# EAGLE design cv-display (EAGLE 9.6.2)
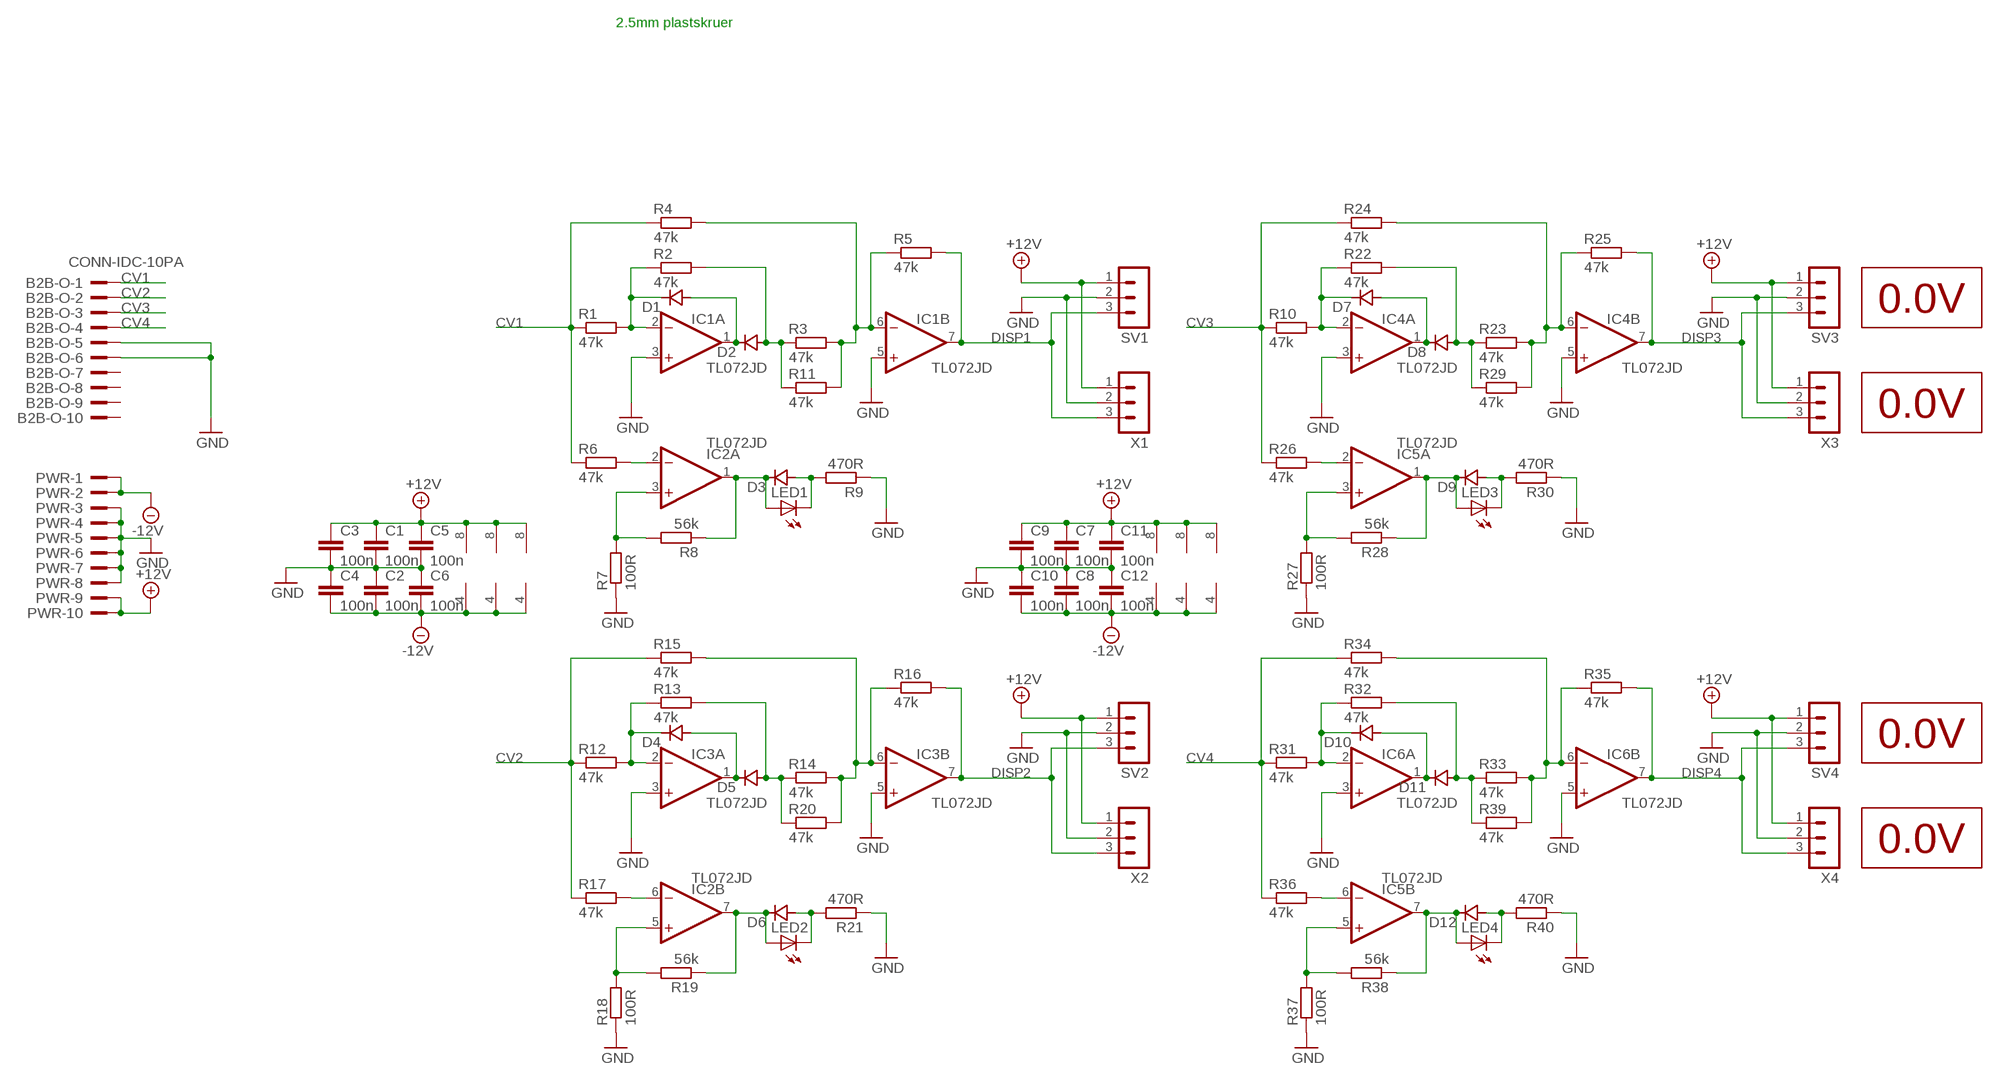
[diagram p0: schematic, sheet 1]

## Parts
B2B-O  CONN-IDC-10PA  [CONN-IDC10P-A]
C1  100n  C-EUC0603  [C0603]
C2  100n  C-EUC0603  [C0603]
C3  100n  C-EUC0603  [C0603]
C4  100n  C-EUC0603  [C0603]
C5  100n  C-EUC0603  [C0603]
C6  100n  C-EUC0603  [C0603]
C7  100n  C-EUC0603  [C0603]
C8  100n  C-EUC0603  [C0603]
C9  100n  C-EUC0603  [C0603]
C10  100n  C-EUC0603  [C0603]
C11  100n  C-EUC0603  [C0603]
C12  100n  C-EUC0603  [C0603]
D1  1N4148SOD323  [SOD323J]
D2  1N4148SOD323  [SOD323J]
D3  1N4148SOD323  [SOD323J]
D4  1N4148SOD323  [SOD323J]
D5  1N4148SOD323  [SOD323J]
D6  1N4148SOD323  [SOD323J]
D7  1N4148SOD323  [SOD323J]
D8  1N4148SOD323  [SOD323J]
D9  1N4148SOD323  [SOD323J]
D10  1N4148SOD323  [SOD323J]
D11  1N4148SOD323  [SOD323J]
D12  1N4148SOD323  [SOD323J]
IC1  TL072JD  [SO08J]
IC2  TL072JD  [SO08J]
IC3  TL072JD  [SO08J]
IC4  TL072JD  [SO08J]
IC5  TL072JD  [SO08J]
IC6  TL072JD  [SO08J]
IC7  VOLTMETER  [VOLTMETER]
IC8  VOLTMETER  [VOLTMETER]
IC9  VOLTMETER  [VOLTMETER]
IC10  VOLTMETER  [VOLTMETER]
LED1  LED_J2X4  [LED2X4-J]
LED2  LED_J2X4  [LED2X4-J]
LED3  LED_J2X4  [LED2X4-J]
LED4  LED_J2X4  [LED2X4-J]
PWR  CONN-IDC-10PA  [CONN-IDC10P-A]
R1  47k  R-EU_R0603  [R0603]
R2  47k  R-EU_R0603  [R0603]
R3  47k  R-EU_R0603  [R0603]
R4  47k  R-EU_R0603  [R0603]
R5  47k  R-EU_R0603  [R0603]
R6  47k  R-EU_R0603  [R0603]
R7  100R  R-EU_R0603  [R0603]
R8  56k  R-EU_R0603  [R0603]
R9  470R  R-EU_R0603  [R0603]
R10  47k  R-EU_R0603  [R0603]
R11  47k  R-EU_R0603  [R0603]
R12  47k  R-EU_R0603  [R0603]
R13  47k  R-EU_R0603  [R0603]
R14  47k  R-EU_R0603  [R0603]
R15  47k  R-EU_R0603  [R0603]
R16  47k  R-EU_R0603  [R0603]
R17  47k  R-EU_R0603  [R0603]
R18  100R  R-EU_R0603  [R0603]
R19  56k  R-EU_R0603  [R0603]
R20  47k  R-EU_R0603  [R0603]
R21  470R  R-EU_R0603  [R0603]
R22  47k  R-EU_R0603  [R0603]
R23  47k  R-EU_R0603  [R0603]
R24  47k  R-EU_R0603  [R0603]
R25  47k  R-EU_R0603  [R0603]
R26  47k  R-EU_R0603  [R0603]
R27  100R  R-EU_R0603  [R0603]
R28  56k  R-EU_R0603  [R0603]
R29  47k  R-EU_R0603  [R0603]
R30  470R  R-EU_R0603  [R0603]
R31  47k  R-EU_R0603  [R0603]
R32  47k  R-EU_R0603  [R0603]
R33  47k  R-EU_R0603  [R0603]
R34  47k  R-EU_R0603  [R0603]
R35  47k  R-EU_R0603  [R0603]
R36  47k  R-EU_R0603  [R0603]
R37  100R  R-EU_R0603  [R0603]
R38  56k  R-EU_R0603  [R0603]
R39  47k  R-EU_R0603  [R0603]
R40  470R  R-EU_R0603  [R0603]
SV1  MA03-1JC  [MA03-1J]
SV2  MA03-1JC  [MA03-1J]
SV3  MA03-1JC  [MA03-1J]
SV4  MA03-1JC  [MA03-1J]
X1  WJ300V-5.0-3P  [WJ300V-5.0-3P]
X2  WJ300V-5.0-3P  [WJ300V-5.0-3P]
X3  WJ300V-5.0-3P  [WJ300V-5.0-3P]
X4  WJ300V-5.0-3P  [WJ300V-5.0-3P]

## Nets
+12V: C1.1 C3.1 C5.1 C7.1 C9.1 C11.1 IC1.8(P:V+) IC2.8(P:V+) IC3.8(P:V+) IC4.8(P:V+) IC5.8(P:V+) IC6.8(P:V+) PWR.9 PWR.10 SV1.1 SV2.1 SV3.1 SV4.1 X1.1 X2.1 X3.1 X4.1
-12V: C2.2 C4.2 C6.2 C8.2 C10.2 C12.2 IC1.4(P:V-) IC2.4(P:V-) IC3.4(P:V-) IC4.4(P:V-) IC5.4(P:V-) IC6.4(P:V-) PWR.1 PWR.2
CV1: B2B-O.1 R1.1 R4.1 R6.1
CV2: B2B-O.2 R12.1 R15.1 R17.1
CV3: B2B-O.3 R10.1 R24.1 R26.1
CV4: B2B-O.4 R31.1 R34.1 R36.1
DISP1: IC1.7(B:OUT) R5.2 SV1.3 X1.3
DISP2: IC3.7(B:OUT) R16.2 SV2.3 X2.3
DISP3: IC4.7(B:OUT) R25.2 SV3.3 X3.3
DISP4: IC6.7(B:OUT) R35.2 SV4.3 X4.3
GND: B2B-O.5 B2B-O.6 C1.2 C2.1 C3.2 C4.1 C5.2 C6.1 C7.2 C8.1 C9.2 C10.1 C11.2 C12.1 IC1.3(A:+IN) IC1.5(B:+IN) IC3.3(A:+IN) IC3.5(B:+IN) IC4.3(A:+IN) IC4.5(B:+IN) IC6.3(A:+IN) IC6.5(B:+IN) PWR.3 PWR.4 PWR.5 PWR.6 PWR.7 PWR.8 R7.1 R9.1 R18.1 R21.1 R27.1 R30.1 R37.1 R40.1 SV1.2 SV2.2 SV3.2 SV4.2 X1.2 X2.2 X3.2 X4.2
N$1: D1.1(C) IC1.2(A:-IN) R1.2 R2.1
N$2: D1.2(A) D2.1(C) IC1.1(A:OUT)
N$3: IC2.3(A:+IN) R7.2 R8.2
N$4: D2.2(A) R2.2 R3.1 R11.1
N$5: D7.1(C) IC4.2(A:-IN) R10.2 R22.1
N$6: D3.1(C) IC2.1(A:OUT) LED1.ANODE(A) R8.1
N$7: D7.2(A) D8.1(C) IC4.1(A:OUT)
N$8: IC1.6(B:-IN) R3.2 R4.2 R5.1 R11.2
N$9: IC2.2(A:-IN) R6.2
N$10: D8.2(A) R22.2 R23.1 R29.1
N$11: IC4.6(B:-IN) R23.2 R24.2 R25.1 R29.2
N$12: D3.2(A) LED1.CATHODE(C) R9.2
N$13: D4.1(C) IC3.2(A:-IN) R12.2 R13.1
N$14: D4.2(A) D5.1(C) IC3.1(A:OUT)
N$15: D5.2(A) R13.2 R14.1 R20.1
N$16: IC3.6(B:-IN) R14.2 R15.2 R16.1 R20.2
N$17: IC2.6(B:-IN) R17.2
N$18: IC2.5(B:+IN) R18.2 R19.2
N$19: D6.1(C) IC2.7(B:OUT) LED2.ANODE(A) R19.1
N$20: D6.2(A) LED2.CATHODE(C) R21.2
N$21: IC5.2(A:-IN) R26.2
N$22: IC5.3(A:+IN) R27.2 R28.2
N$23: D9.1(C) IC5.1(A:OUT) LED3.ANODE(A) R28.1
N$24: D9.2(A) LED3.CATHODE(C) R30.2
N$25: D10.1(C) IC6.2(A:-IN) R31.2 R32.1
N$26: D10.2(A) D11.1(C) IC6.1(A:OUT)
N$27: D11.2(A) R32.2 R33.1 R39.1
N$28: IC6.6(B:-IN) R33.2 R34.2 R35.1 R39.2
N$29: IC5.6(B:-IN) R36.2
N$30: IC5.5(B:+IN) R37.2 R38.2
N$31: D12.1(C) IC5.7(B:OUT) LED4.ANODE(A) R38.1
N$32: D12.2(A) LED4.CATHODE(C) R40.2
Unconnected: B2B-O.7 B2B-O.8 B2B-O.9 B2B-O.10

## Notes on the sheet
- 2.5mm plastskruer

## Library data of the parts
B2B-O PWR = joakim:CONN-IDC-10P: 10P IDC Header; OC_FARNELL: 1788669; OC_NEWARK: unknown
C1-C12 = rcl:C-EU: CAPACITOR, European symbol; SPICEPREFIX: C
D1-D12 = joakim:1N4148: DIODE high speed (Philips)
IC1-IC6 = joakim:TL072J: OP AMP
IC7-IC10 = joakim:VOLTMETER
LED1-LED4 = joakim-old:LED_J: LED Everlight: rectangular 2 x 4 mm, 594
R1-R40 = rcl:R-EU_: RESISTOR, European symbol; SPICEPREFIX: R
SV1-SV4 = joakim:MA03-1J: PIN HEADER; OC_FARNELL: unknown; OC_NEWARK: unknown
X1-X4 = joakim:WJ300V-5.0-3P: 3p screw terminal Ningbo Kangnex Elec WJ300V-5.0-3P JLCPCB: C8467 5mm pin pitch

## Board
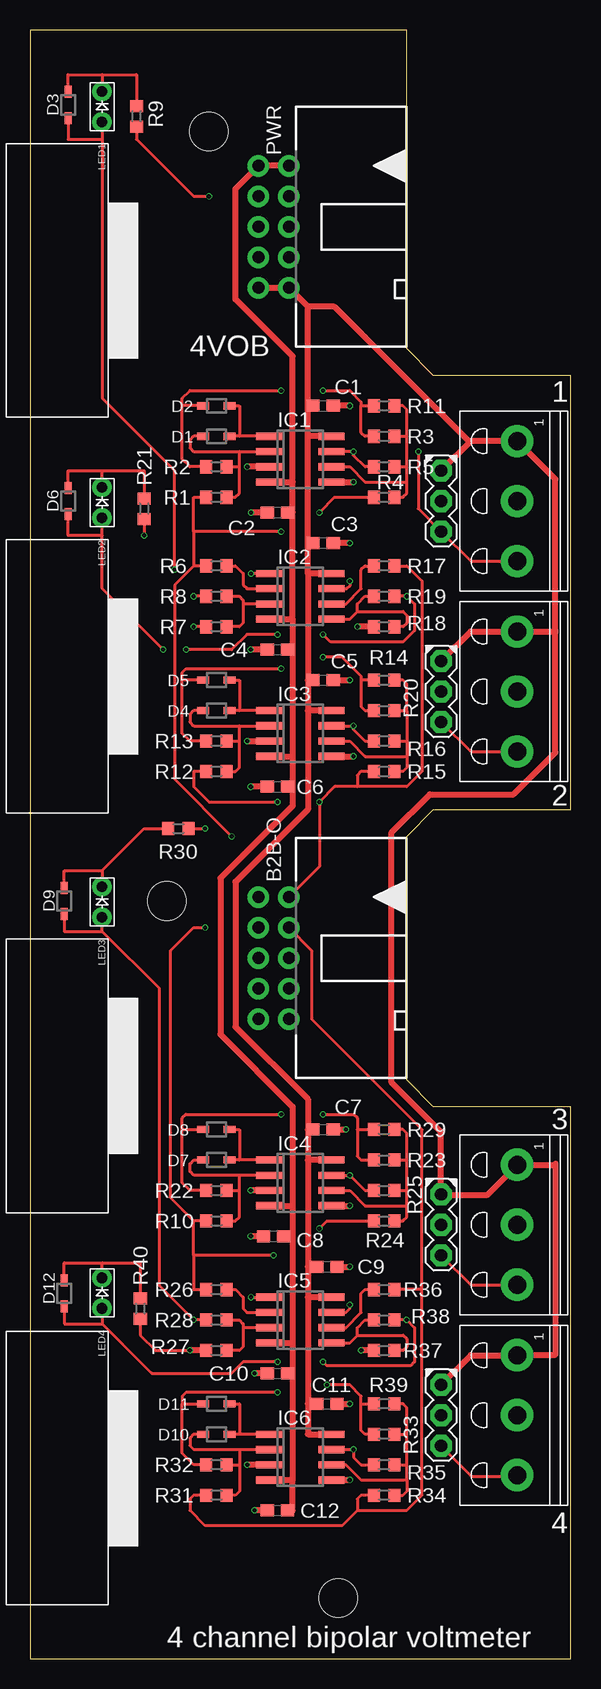
[diagram p1: board, top side]
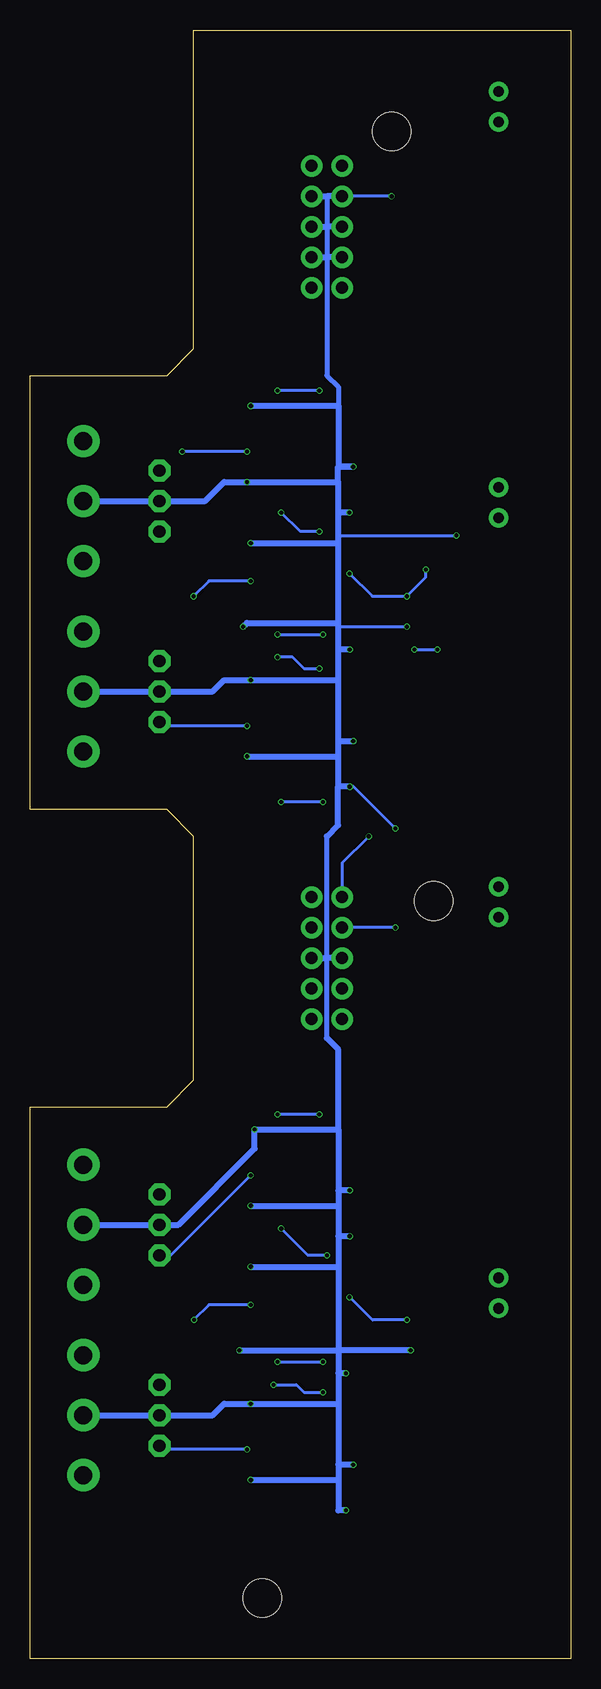
[diagram p2: board, bottom side, seen from below]

Size 45.09 x 135.79 mm. Coordinates in mm from the lower left corner, seen from the top.
Outline: 0,0 45.09,0 45.09,46.04 33.66,46.04 31.43,48.26 31.43,68.58 33.66,70.8 45.09,70.8 45.09,107 33.66,107 31.43,109.22 31.43,135.79 0,135.79 0,0
Copper layers (1*16): Top 0.035mm / dielectric 1.6mm / Bottom 0.035mm
Design rules "jlcpcb-2layers": minimum track width 5mil, minimum drill 0.3mm, track to track 5mil, track to pad 5mil, pad to pad 5mil, via to via 5mil, smd to smd 5mil, copper to edge 0.2mm, drill to drill 6mil, minimum pad ring 10mil, minimum via ring 3mil, stop-mask expansion 4mil, vias tented up to drill 0mil, thermal gap 10mil
Holes 3.2 mm at 25.72,5.08 11.43,63.18 14.92,127.32

### Footprints (pad centres in the part's own frame; a part is rotated, then mirrored left to right if it is on the bottom)
CONN-IDC10P-A = drill 1 pad 1.422: 1 -5.08,-1.27; 2 -5.08,1.27; 3 -2.54,-1.27; 4 -2.54,1.27; 5 0,-1.27; 6 0,1.27; 7 2.54,-1.27; 8 2.54,1.27; 9 5.08,-1.27; 10 5.08,1.27
C0603 = smd 1.1 x 1: 1 -0.85,0; 2 0.85,0
SOD323J = smd 1 x 0.6: 1 -1.1,0; 2 1.1,0
SO08J = smd 0.6 x 2.2: 1 -1.905,-2.6; 2 -0.635,-2.6; 3 0.635,-2.6; 4 1.905,-2.6; 5 1.905,2.6; 6 0.635,2.6; 7 -0.635,2.6; 8 -1.905,2.6
LED2X4-J = drill 0.9: ANODE -1.27,0; CATHODE 1.27,0
R0603 = smd 1 x 1.1: 1 -0.85,0; 2 0.85,0
MA03-1J = drill 1.016 octagon: 1 -2.54,0; 2 0,0; 3 2.54,0
WJ300V-5.0-3P = drill 1.5: 1 -5,0; 2 0,0; 3 5,0

### Placement (x,y rotation side)
B2B-O  20.32,58.42 270 top
C1  24.45,104.46 0 top
C2  20.64,95.57 0 top
C3  24.45,93.03 0 top
C4  20.64,84.14 0 top
C5  24.45,81.6 0 top
C6  20.64,72.71 0 top
C7  24.45,44.13 0 top
C8  20.32,35.24 0 top
C9  24.77,32.7 0 top
C10  20.64,23.81 0 top
C11  24.77,21.27 0 top
C12  20.64,12.38 0 top
D1  15.56,101.92 0 top
D2  15.56,104.46 180 top
D3  3.17,129.54 90 top
D4  15.56,79.06 0 top
D5  15.56,81.6 180 top
D6  3.17,96.52 90 top
D7  15.56,41.59 0 top
D8  15.56,44.13 180 top
D9  2.86,63.18 90 top
D10  15.56,18.73 0 top
D11  15.56,21.27 180 top
D12  2.86,30.48 90 top
IC1  22.54,100.01 270 top
IC2  22.54,88.58 270 top
IC3  22.54,77.15 270 top
IC4  22.54,39.69 270 top
IC5  22.54,28.26 270 top
IC6  22.54,16.83 270 top
IC7  -2,114.9 270 top
IC8  -2,81.9 270 top
IC9  -2,48.6 270 top
IC10  -2,15.9 270 top
LED1  6,129.4 90 top
LED2  6,96.4 90 top
LED3  6,63.1 90 top
LED4  6,30.5 90 top
PWR  20.32,119.38 270 top
R1  15.56,96.84 0 top
R2  15.56,99.38 180 top
R3  29.53,101.92 0 top
R4  29.53,96.84 0 top
R5  29.53,99.38 180 top
R6  15.56,91.12 0 top
R7  15.56,86.04 0 top
R8  15.56,88.58 0 top
R9  8.89,128.59 90 top
R10  15.56,36.51 0 top
R11  29.53,104.46 0 top
R12  15.56,73.98 0 top
R13  15.56,76.52 180 top
R14  29.53,81.6 0 top
R15  29.53,73.98 0 top
R16  29.53,76.52 180 top
R17  29.53,91.12 180 top
R18  29.53,86.04 0 top
R19  29.53,88.58 180 top
R20  29.53,79.06 0 top
R21  9.53,95.89 90 top
R22  15.56,39.05 180 top
R23  29.53,41.59 0 top
R24  29.53,36.51 0 top
R25  29.53,39.05 180 top
R26  15.56,30.8 0 top
R27  15.56,25.72 0 top
R28  15.56,28.26 0 top
R29  29.53,44.13 0 top
R30  12.38,69.22 180 top
R31  15.56,13.65 0 top
R32  15.56,16.19 180 top
R33  29.53,18.73 0 top
R34  29.53,13.65 0 top
R35  29.53,16.19 180 top
R36  29.53,30.8 180 top
R37  29.53,25.72 0 top
R38  29.53,28.26 180 top
R39  29.53,21.27 0 top
R40  9.21,29.21 90 top
SV1  34.29,96.52 270 top
SV2  34.29,80.64 270 top
SV3  34.29,36.2 270 top
SV4  34.29,20.32 270 top
X1  40.64,96.52 270 top
X2  40.64,80.64 270 top
X3  40.64,36.2 270 top
X4  40.64,20.32 270 top

### Tracks (layer width: path | path; a pad name or v marks a point on that pad's centre or on a via)
+12V
  Top 0.254: C1.1 23.18,104.46
  Top 0.508: IC1.8 23.18,101.92 | 23.18,90.49 23.18,93.03 | 23.18,93.03 23.18,101.92 | IC2.8 23.18,90.49 | 23.18,90.49 23.18,81.6 | 23.18,81.6 23.18,79.06 | IC3.8 23.18,79.06 | C5.1 23.18,81.6 | C3.1 23.18,93.03 | 23.18,79.06 23.18,70.8 17.14,64.77 17.14,52.7 23.18,46.67 23.18,44.13 | IC6.8 23.18,18.73 23.18,21.27 | 23.18,44.13 23.18,41.59 | 23.18,41.59 23.18,32.7 | 23.18,32.7 23.18,30.16 | 23.18,30.16 23.18,21.27 | C11.1 23.18,21.27 | C9.1 23.18,32.7 | IC5.8 23.18,30.16 | IC4.8 23.18,41.59 | C7.1 23.18,44.13 | PWR.9 PWR.10 23.18,112.71 | 23.18,101.92 23.18,104.46 23.18,112.71 | 43.73,85.64 X2.1 36.75,85.64 SV2.1 | 43.73,85.64 43.81,85.72 43.81,98.34 X1.1 36.75,101.52 | SV4.1 36.75,25.32 X4.1 43.73,25.32 43.81,25.4 43.81,41.27 43.73,41.2 X3.1 38.1,38.66 34.37,38.66 SV3.1 34.29,43.92 30.16,48.05 30.16,68.9 33.34,72.07 40.32,72.07 43.81,75.56 43.81,85.56 43.73,85.64 | SV1.1 36.75,101.52 | 36.75,101.52 36.59,101.52 25.4,112.71 23.18,112.71
-12V
  Top 0.508: IC1.4 21.91,98.11 | 21.91,86.68 21.91,95.57 | 21.91,95.57 21.91,98.11 | IC2.4 21.91,86.68 | C2.2 21.91,95.57 | 21.91,86.68 21.91,84.14 | 21.91,84.14 21.91,75.25 | 21.91,75.25 21.91,72.71 | C4.2 21.91,84.14 | C6.2 21.91,72.71 | IC3.4 21.91,75.25 | 21.91,72.71 21.91,71.12 15.88,65.09 15.88,52.07 21.91,46.04 21.91,37.78 | 21.91,37.78 21.91,35.24 | 21.91,35.24 21.91,26.35 | 21.91,26.35 21.91,23.81 | 21.91,23.81 21.91,14.92 | 21.91,14.92 21.91,12.38 C12.2 | IC6.4 21.91,14.92 | IC5.4 21.91,26.35 | C10.2 21.91,23.81 | C8.2 21.91,35.24 | IC4.4 21.91,37.78 | PWR.2 PWR.1 17.14,122.56 17.14,113.35 21.91,108.58 21.91,98.11
CV1  (via drill 0.35)
  Top 0.254: R6.1 13.65,91.12 | R1.1 13.65,96.84 13.65,93.98 | 20.93,94 v20.95,93.98 13.65,93.98 | v24.13,95.57 25.4,96.84 R4.1 | 13.65,93.98 13.65,91.12 | 13.65,91.12 12.06,89.53 12.06,73.34 v16.83,68.58
  Bottom 0.254: v20.95,93.98 22.54,93.98 v24.13,95.57 | B2B-O.1 19.05,66.36 v16.83,68.58
CV2  (via drill 0.35)
  Top 0.254: R12.1 13.65,73.98 13.65,72.71 14.92,71.44 v20.64,71.44 | R17.1 31.43,91.12 32.7,89.85 32.7,73.98 31.43,72.71 27.3,72.71 | R15.1 27.62,73.98 27.3,73.66 27.3,72.71 | 27.3,72.71 25.4,72.71 v24.13,71.44 24.13,66.04 B2B-O.2
  Bottom 0.254: v20.64,71.44 v24.13,71.44
CV3  (via drill 0.35)
  Top 0.254: R10.1 13.65,36.51 | 13.65,33.66 13.65,36.51 | v20.32,33.66 13.65,33.66 | v24.13,35.88 24.77,36.51 R24.1 | 13.65,36.51 11.75,38.42 11.75,59.05 13.65,60.96 v14.61,60.96 | 13.65,33.66 13.65,30.8 R26.1
  Bottom 0.254: v20.32,33.66 21.91,33.66 v24.13,35.88 | v14.61,60.96 B2B-O.3
CV4
  Top 0.254: R31.1 13.65,13.65 13.34,13.34 13.34,12.38 14.61,11.11 26.04,11.11 27.3,12.38 | R34.1 27.62,13.65 27.3,13.34 27.3,12.38 | 27.3,12.38 31.43,12.38 32.7,13.65 32.7,30.8 | 32.7,30.8 R36.1 | B2B-O.4 23.5,59.05 23.5,53.34 32.7,44.13 32.7,30.8
DISP1  (via drill 0.35)
  Top 0.254: IC1.7 v26.99,100.65 26.99,100.33 27.94,99.38 R5.2 | v32.38,100.65 32.38,95.89 SV1.3 36.75,91.52 X1.3
  Bottom 0.254: v26.99,100.65 v32.38,100.65
DISP2  (via drill 0.35)
  Top 0.254: IC3.7 v26.99,77.79 26.99,77.47 27.94,76.52 R16.2 | SV2.3 36.75,75.64 X2.3
  Bottom 0.254: SV2.3 33.97,77.79 v26.99,77.79
DISP3  (via drill 0.35)
  Top 0.254: IC4.7 v26.67,40.32 27.94,39.05 R25.2 | SV3.3 36.75,31.2 X3.3
  Bottom 0.254: v26.67,40.32 33.34,33.66 SV3.3
DISP4  (via drill 0.35)
  Top 0.254: IC6.7 v26.99,17.46 26.99,16.83 27.62,16.19 R35.2 | SV4.3 36.83,15.24 40.56,15.24 X4.3
  Bottom 0.254: SV4.3 33.97,17.46 v26.99,17.46
GND  (via drill 0.35)
  Top 0.254: R7.1 v13.65,86.04 | R40.1 9.21,26.99 10.48,25.72 v13.34,25.72 | R30.1 v14.61,69.22 | R21.1 v9.53,93.66 | R9.1 8.89,126.68 13.65,121.92 v14.92,121.92
  Top 0.508: v26.67,104.46 C1.2 | IC1.3 v18.12,99.38 | C2.1 v18.44,95.57 18.41,95.57 | IC1.5 v26.99,98.11 | v26.67,93.03 C3.2 | C5.2 v26.67,81.6 | IC3.5 v26.99,75.25 | v18.12,76.52 IC3.3 | C6.1 v18.41,72.71 | C4.1 v18.41,84.14 | R18.1 v27.3,86.04 | C8.1 v18.41,35.24 | IC4.3 v18.41,39.05 | IC4.5 v26.67,37.78 | C7.2 v26.35,44.13 | C9.2 v26.67,32.7 | C11.2 v26.67,21.27 | C10.1 v18.73,23.81 | C12.1 v18.73,12.38 | IC6.5 v26.67,14.92 | R37.1 v27.62,25.72 | R27.1 v13.34,25.72 | IC6.3 v18.12,16.19 18.1,16.19
  Bottom 0.254: 19.39,86.04 v13.65,86.04 | v14.61,69.22 18.1,72.71 v18.41,72.71 | 19.39,93.66 v9.53,93.66 | v14.92,121.92 PWR.3
  Bottom 0.406: 20.32,51.75 20.32,58.42 20.32,68.58 | 19.37,104.46 19.37,106.05 20.32,107 20.32,116.84 20.32,119.38 20.32,121.92
  Bottom 0.508: v26.67,104.46 19.37,104.46 19.37,99.36 19.34,99.38 v18.12,99.38 19.39,99.38 19.39,98.11 | 19.39,98.11 19.39,95.57 | v18.44,95.57 19.39,95.57 | 19.39,95.57 19.39,93.66 19.39,93.03 | 19.39,93.03 19.39,86.36 | 19.39,86.36 19.39,86.04 19.39,84.14 | 19.39,84.14 19.39,81.6 | 19.39,81.6 19.39,76.52 | 19.39,76.52 19.39,75.25 | 19.39,75.25 19.39,72.71 | 19.39,98.11 v26.99,98.11 28.89,98.11 30.48,96.52 SV1.2 X1.2 | v26.67,93.03 19.39,93.03 | 19.39,81.6 v26.67,81.6 28.89,81.6 29.84,80.64 SV2.2 X2.2 | v26.99,75.25 19.39,75.25 | 19.39,76.52 v18.12,76.52 18.1,76.52 | v18.41,72.71 19.39,72.71 | v18.41,84.14 19.39,84.14 | v27.3,86.04 26.99,86.36 19.39,86.36 | 19.37,44.13 19.37,39.05 | 19.37,39.05 19.37,37.78 | 19.37,37.78 19.37,35.24 | 19.37,35.24 19.37,32.7 | 19.37,32.7 19.37,25.72 | 19.37,25.72 19.37,23.81 | 19.37,23.81 19.37,21.27 | 19.37,21.27 19.37,16.19 | 19.37,16.19 19.37,14.92 | 19.37,14.92 19.37,12.38 v18.73,12.38 | v18.41,35.24 19.37,35.24 | v18.41,39.05 19.37,39.05 | v26.67,37.78 19.37,37.78 | v26.67,32.7 19.37,32.7 | 19.37,21.27 v26.67,21.27 28.89,21.27 29.84,20.32 SV4.2 X4.2 | v18.73,23.81 19.37,23.81 | v26.67,14.92 19.37,14.92 | v27.62,25.72 19.37,25.72 | v13.34,25.72 19.37,25.72 | v18.12,16.19 19.37,16.19 | X3.2 SV3.2 32.7,36.2 26.35,42.55 v26.35,44.13 19.37,44.13 | 19.37,116.52 PWR.7 20.32,116.84 PWR.8 | B2B-O.5 20.32,58.42 B2B-O.6 | 19.39,72.71 19.39,69.51 20.32,68.58 | PWR.3 20.32,121.92 PWR.4 | PWR.5 20.32,119.38 PWR.6 | 19.37,44.13 19.37,50.8 20.32,51.75
N$1
  Top 0.254: D1.1 13.65,101.92 13.34,101.6 13.34,100.97 13.65,100.65 17.46,100.65 | 17.46,100.65 IC1.2 | R1.2 17.14,96.84 17.46,97.16 17.46,99.38 | 17.46,99.38 17.46,100.65 | R2.1 17.46,99.38
N$2
  Top 0.254: IC1.1 17.46,101.92 | 17.46,101.92 D1.2 | D2.1 17.46,104.46 17.46,101.92
N$3
  Top 0.254: R8.2 17.46,88.58 17.78,88.27 17.78,87.95 | 17.78,87.95 17.78,86.36 17.46,86.04 R7.2 | IC2.3 17.78,87.95
N$4  (via drill 0.35)
  Top 0.254: R2.2 13.34,99.38 12.7,100.01 12.7,104.46 | D2.2 12.7,104.46 | R3.1 27.94,101.92 27.62,102.23 27.62,104.46 | 27.62,104.46 R11.1 | 12.7,104.46 12.7,105.09 13.34,105.73 v20.95,105.73 | v24.45,105.73 26.67,105.73 27.62,104.78 27.62,104.46
  Bottom 0.254: v20.95,105.73 v24.45,105.73
N$5
  Top 0.254: R10.2 17.14,36.51 17.46,36.83 17.46,39.05 | 17.46,39.05 17.46,40.32 | IC4.2 17.46,40.32 | R22.1 17.46,39.05 | 17.46,40.32 13.65,40.32 13.34,40.64 13.34,41.27 13.65,41.59 D7.1
N$6  (via drill 0.35)
  Top 0.254: R8.1 v13.65,88.58 | IC2.1 v18.44,90.49 | v12.06,90.81 12.06,99.06 6.03,105.09 6.03,126.36 6.03,126.68 | D3.1 3.17,126.68 6.03,126.68 | LED1.ANODE 6.03,128.1 6.03,126.68
  Bottom 0.254: v18.44,90.49 16.53,88.58 v13.65,88.58 12.06,90.17 v12.06,90.81
N$7
  Top 0.254: D8.1 17.46,44.13 17.46,41.59 | 17.46,41.59 D7.2 | IC4.1 17.46,41.59
N$8
  Top 0.254: R4.2 31.11,96.84 31.43,97.16 31.43,98.11 | 31.43,98.11 31.43,99.38 | 31.43,99.38 31.43,101.92 | 31.43,101.92 31.43,104.14 31.11,104.46 R11.2 | R3.2 31.43,101.92 | R5.1 31.43,99.38 | IC1.6 26.67,99.38 27.94,98.11 31.43,98.11
N$9
  Top 0.254: R6.2 17.14,91.12 17.78,90.49 17.78,89.53 18.1,89.22 IC2.2
N$10  (via drill 0.35)
  Top 0.254: R22.2 13.34,39.05 12.7,39.69 12.7,44.13 | 12.7,44.13 D8.2 | 12.7,44.13 12.7,45.09 13.02,45.4 v20.95,45.4 | v24.45,45.4 26.99,45.4 27.3,45.09 27.3,44.13 | 27.3,44.13 27.3,41.91 27.62,41.59 R23.1 | 27.3,44.13 R29.1
  Bottom 0.254: v20.95,45.4 v24.45,45.4
N$11
  Top 0.254: R24.2 31.11,36.51 31.43,36.83 31.43,37.78 | 31.43,37.78 31.43,39.05 | 31.43,39.05 31.43,41.59 | 31.43,41.59 31.43,43.81 31.11,44.13 R29.2 | R23.2 31.43,41.59 | R25.1 31.43,39.05 | IC4.6 26.67,39.05 27.94,37.78 31.43,37.78
N$12
  Top 0.254: D3.2 3.17,132.08 6.03,132.08 | 6.03,132.08 6.03,130.7 LED1.CATHODE | R9.2 8.89,132.08 6.03,132.08
N$13
  Top 0.254: D4.1 13.65,79.06 13.34,78.74 13.34,78.11 13.65,77.79 17.46,77.79 | 17.46,77.79 IC3.2 | R13.1 17.46,76.52 | 17.46,76.52 17.46,77.79 | R12.2 17.14,73.98 17.46,74.3 17.46,76.52
N$14
  Top 0.254: IC3.1 17.46,79.06 | 17.46,79.06 D4.2 | D5.1 17.46,81.6 17.46,79.06
N$15  (via drill 0.35)
  Top 0.254: R13.2 13.34,76.52 12.7,77.15 12.7,81.6 | D5.2 12.7,81.6 | 12.7,81.6 12.7,82.23 13.02,82.55 v20.95,82.55 | v24.45,83.5 26.04,83.5 27.62,81.92 27.62,81.6 | 27.62,81.6 27.62,79.38 27.94,79.06 R20.1 | R14.1 27.62,81.6
  Bottom 0.254: v24.45,83.5 23.18,83.5 22.23,82.55 v20.95,82.55
N$16
  Top 0.254: R20.2 31.43,79.06 | 31.43,79.06 31.43,81.28 31.11,81.6 R14.2 | 31.43,79.06 31.43,76.52 | 31.43,76.52 31.43,75.25 | 31.43,75.25 31.43,74.3 31.11,73.98 R15.2 | R16.1 31.43,76.52 | IC3.6 26.67,76.52 27.94,75.25 31.43,75.25
N$17
  Top 0.254: IC2.6 26.35,87.95 27.62,89.22 27.62,90.81 27.94,91.12 R17.2
N$18
  Top 0.254: R19.2 27.94,88.58 27.3,87.95 27.3,87.31 | IC2.5 26.67,86.68 27.3,87.31 | R18.2 31.11,86.04 31.43,86.36 31.43,87 31.11,87.31 27.3,87.31
N$19  (via drill 0.35)
  Top 0.254: IC2.7 26.41,89.22 26.67,89.47 v26.67,89.85 | R19.1 v31.43,88.58 32.07,87.95 32.07,85.72 31.11,84.77 25.08,84.77 v24.45,85.41 | v20.64,85.41 18.1,85.41 16.83,84.14 v13.02,84.14 | v11.11,84.14 6.03,89.22 6.03,93.66 | D6.1 3.17,93.66 6.03,93.66 | 6.03,93.66 6.03,95.1 LED2.ANODE
  Bottom 0.254: v26.67,89.85 30.16,89.85 v31.43,88.58 | v24.45,85.41 v20.64,85.41 | v13.02,84.14 v11.11,84.14
N$20
  Top 0.254: D6.2 3.17,99.06 6.03,99.06 | 6.03,99.06 9.53,99.06 R21.2 | LED2.CATHODE 6.03,97.67 6.03,99.06
N$21
  Top 0.254: R26.2 17.14,30.8 17.78,30.16 17.78,29.21 18.1,28.89 IC5.2
N$22
  Top 0.254: R28.2 17.46,28.26 17.78,27.94 17.78,27.62 | 17.78,27.62 17.78,26.04 17.46,25.72 R27.2 | IC5.3 17.78,27.62
N$23  (via drill 0.35)
  Top 0.254: R28.1 v13.65,28.26 10.79,31.11 10.79,55.88 6.03,60.64 | v18.44,30.16 IC5.1 | D9.1 2.86,60.64 6.03,60.64 | 6.03,60.64 6.03,61.8 LED3.ANODE
  Bottom 0.254: v13.65,28.26 16.51,28.26 18.41,30.16 v18.44,30.16
N$24
  Top 0.254: 6.03,65.72 9.53,69.22 R30.2 | D9.2 2.86,65.72 6.03,65.72 | 6.03,65.72 6.03,64.4 LED3.CATHODE
N$25
  Top 0.254: D10.1 13.65,18.73 13.34,18.41 13.34,17.78 13.65,17.46 17.46,17.46 | 17.46,17.46 IC6.2 | 17.46,17.46 17.46,16.19 | 17.46,16.19 17.46,13.97 17.14,13.65 R31.2 | R32.1 17.46,16.19
N$26
  Top 0.254: D11.1 17.46,21.27 17.46,18.73 | 17.46,18.73 D10.2 | IC6.1 17.46,18.73
N$27  (via drill 0.35)
  Top 0.254: R32.2 13.65,16.19 12.7,17.14 12.7,21.27 | R33.1 27.94,18.73 27.62,19.05 27.62,21.27 | 27.62,21.27 R39.1 | 27.62,21.27 27.62,21.91 26.67,22.86 v24.77,22.86 | 12.7,21.27 12.7,21.91 13.02,22.23 v20.64,22.23 | 12.7,21.27 D11.2
  Bottom 0.254: v24.77,22.86 22.86,22.86 22.23,22.23 v20.64,22.23
N$28
  Top 0.254: R34.2 31.11,13.65 31.43,13.97 31.43,14.92 | IC6.6 26.35,16.19 27.62,14.92 31.43,14.92 | 31.43,14.92 31.43,16.19 | 31.43,16.19 31.43,18.73 | 31.43,18.73 31.43,20.95 31.11,21.27 R39.2 | R33.2 31.43,18.73 | R35.1 31.43,16.19
N$29
  Top 0.254: IC5.6 26.35,27.62 27.62,28.89 27.62,30.48 27.94,30.8 R36.2
N$30
  Top 0.254: IC5.5 26.67,26.35 27.3,26.99 | 27.3,26.99 31.11,26.99 31.43,26.67 31.43,26.04 31.11,25.72 R37.2 | 27.3,26.99 27.3,27.62 27.94,28.26 R38.2
N$31  (via drill 0.35)
  Top 0.254: IC5.7 26.35,28.89 26.67,29.21 v26.67,29.53 | R38.1 v31.41,28.26 31.43,28.26 32.07,27.62 32.07,24.77 31.75,24.45 24.77,24.45 v24.45,24.77 | v20.64,24.77 17.78,24.77 16.83,23.81 10.16,23.81 6.03,27.94 | D12.1 2.86,27.94 6.03,27.94 | LED4.ANODE 6.03,29.2 6.03,27.94
  Bottom 0.254: v26.67,29.53 30.16,29.53 31.43,28.26 v31.41,28.26 | v24.45,24.77 v20.64,24.77
N$32
  Top 0.254: D12.2 2.86,33.02 6.03,33.02 | 6.03,33.02 9.21,33.02 R40.2 | LED4.CATHODE 6,32.99 6.03,33.02

### Text on the board
tNames: 4VOB | 1 | 2 | 3 | 4 | 4 channel bipolar voltmeter